# Altium schematic sheet MCUConn.SchDoc
size 431 x 279 mm; Organization: ORGANIZATION; Address1: ADDRESS 1; Address2: ADDRESS 2; Address3: ADDRESS 3; Address4: ADDRESS 4; Revision: -; SheetNumber: 7; SheetTotal: 7; ENG_APP_DATE: --/--/--; DSN_APP_DATE: --/--/--; CHK_APP_DATE: --/--/--
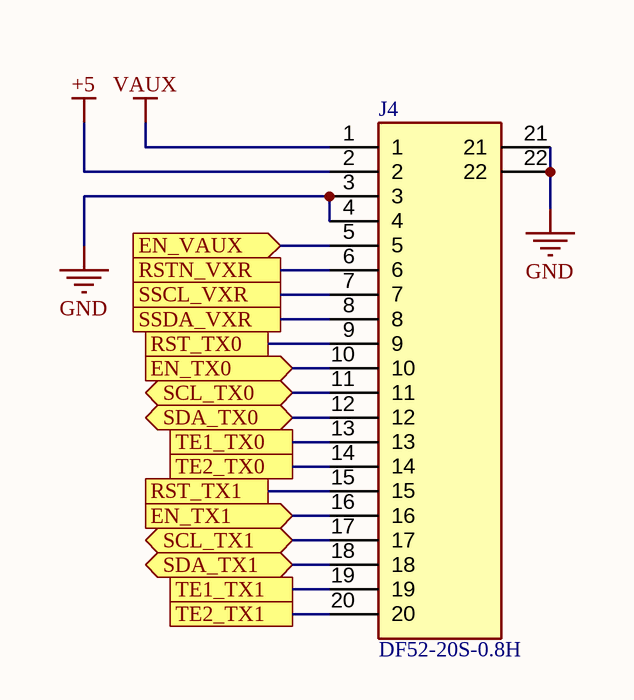
[diagram p0: MCUConn.SchDoc]

## Parts
J4  DF52-20S-0.8H  [DF5220S08H]

## Ports
EN_TX0 (in), EN_TX1 (in), EN_VAUX (in), RST_TX0, RST_TX1, RSTN_VXR, SCL_TX0 (bidir), SCL_TX1 (bidir), SDA_TX0 (bidir), SDA_TX1 (bidir), SSCL_VXR, SSDA_VXR, TE1_TX0, TE1_TX1, TE2_TX0, TE2_TX1

## Nets
+5: J4.2
GND: J4.3 J4.4 J4.21 J4.22
VAUX: J4.1
EN_TX0: J4.10 ; port EN_TX0
EN_TX1: J4.16 ; port EN_TX1
EN_VAUX: J4.5 ; port EN_VAUX
RST_TX0: J4.9 ; port RST_TX0
RST_TX1: J4.15 ; port RST_TX1
RSTN_VXR: J4.6 ; port RSTN_VXR
SCL_TX0: J4.11 ; port SCL_TX0
SCL_TX1: J4.17 ; port SCL_TX1
SDA_TX0: J4.12 ; port SDA_TX0
SDA_TX1: J4.18 ; port SDA_TX1
SSCL_VXR: J4.7 ; port SSCL_VXR
SSDA_VXR: J4.8 ; port SSDA_VXR
TE1_TX0: J4.13 ; port TE1_TX0
TE1_TX1: J4.19 ; port TE1_TX1
TE2_TX0: J4.14 ; port TE2_TX0
TE2_TX1: J4.20 ; port TE2_TX1

## Notes on the sheet
- DWG. NO.
- REV.
- SHT.
- REVISION
- DESCRIPTION
- DATE
- APPROVED
- ENG:
- APPROVALS
- PROJECT
- DSN:
- CHK:
- REFERENCE DOCUMENTS
- PROJECT REVISION:
- TITLE
- SimulaVR
- DOCUMENT REVISION:
- DESIGN ITEM:
- BOM:
- FAB DWG:
- PCB DWG:
- ASSY DWG:
- SCALE:
- SIZE
- B
- CAGE CODE
- FILE NAME
- DWG NO.
- SHEET
- OF
- REV

## Library data of the parts
J4 = DF52-20S-0.8H: Connector; Manufacturer_Name: Hirose; Datasheet Link: https://www.mouser.com/datasheet/2/185/DF52_catalog-939321.pdf; Height: 1mm; Manufacturer_Part_Number: DF52-20S-0.8H